# EAGLE design 11x17-base (EAGLE 7.7.0)
COPYRIGHT: Copyright (C) 2023 All Rights Reserved; DRAWN_BY: Brett A. Farnam; REV: 3.6; REV_DATE: 09/07/2023; TITLE: Values in Global Attributes
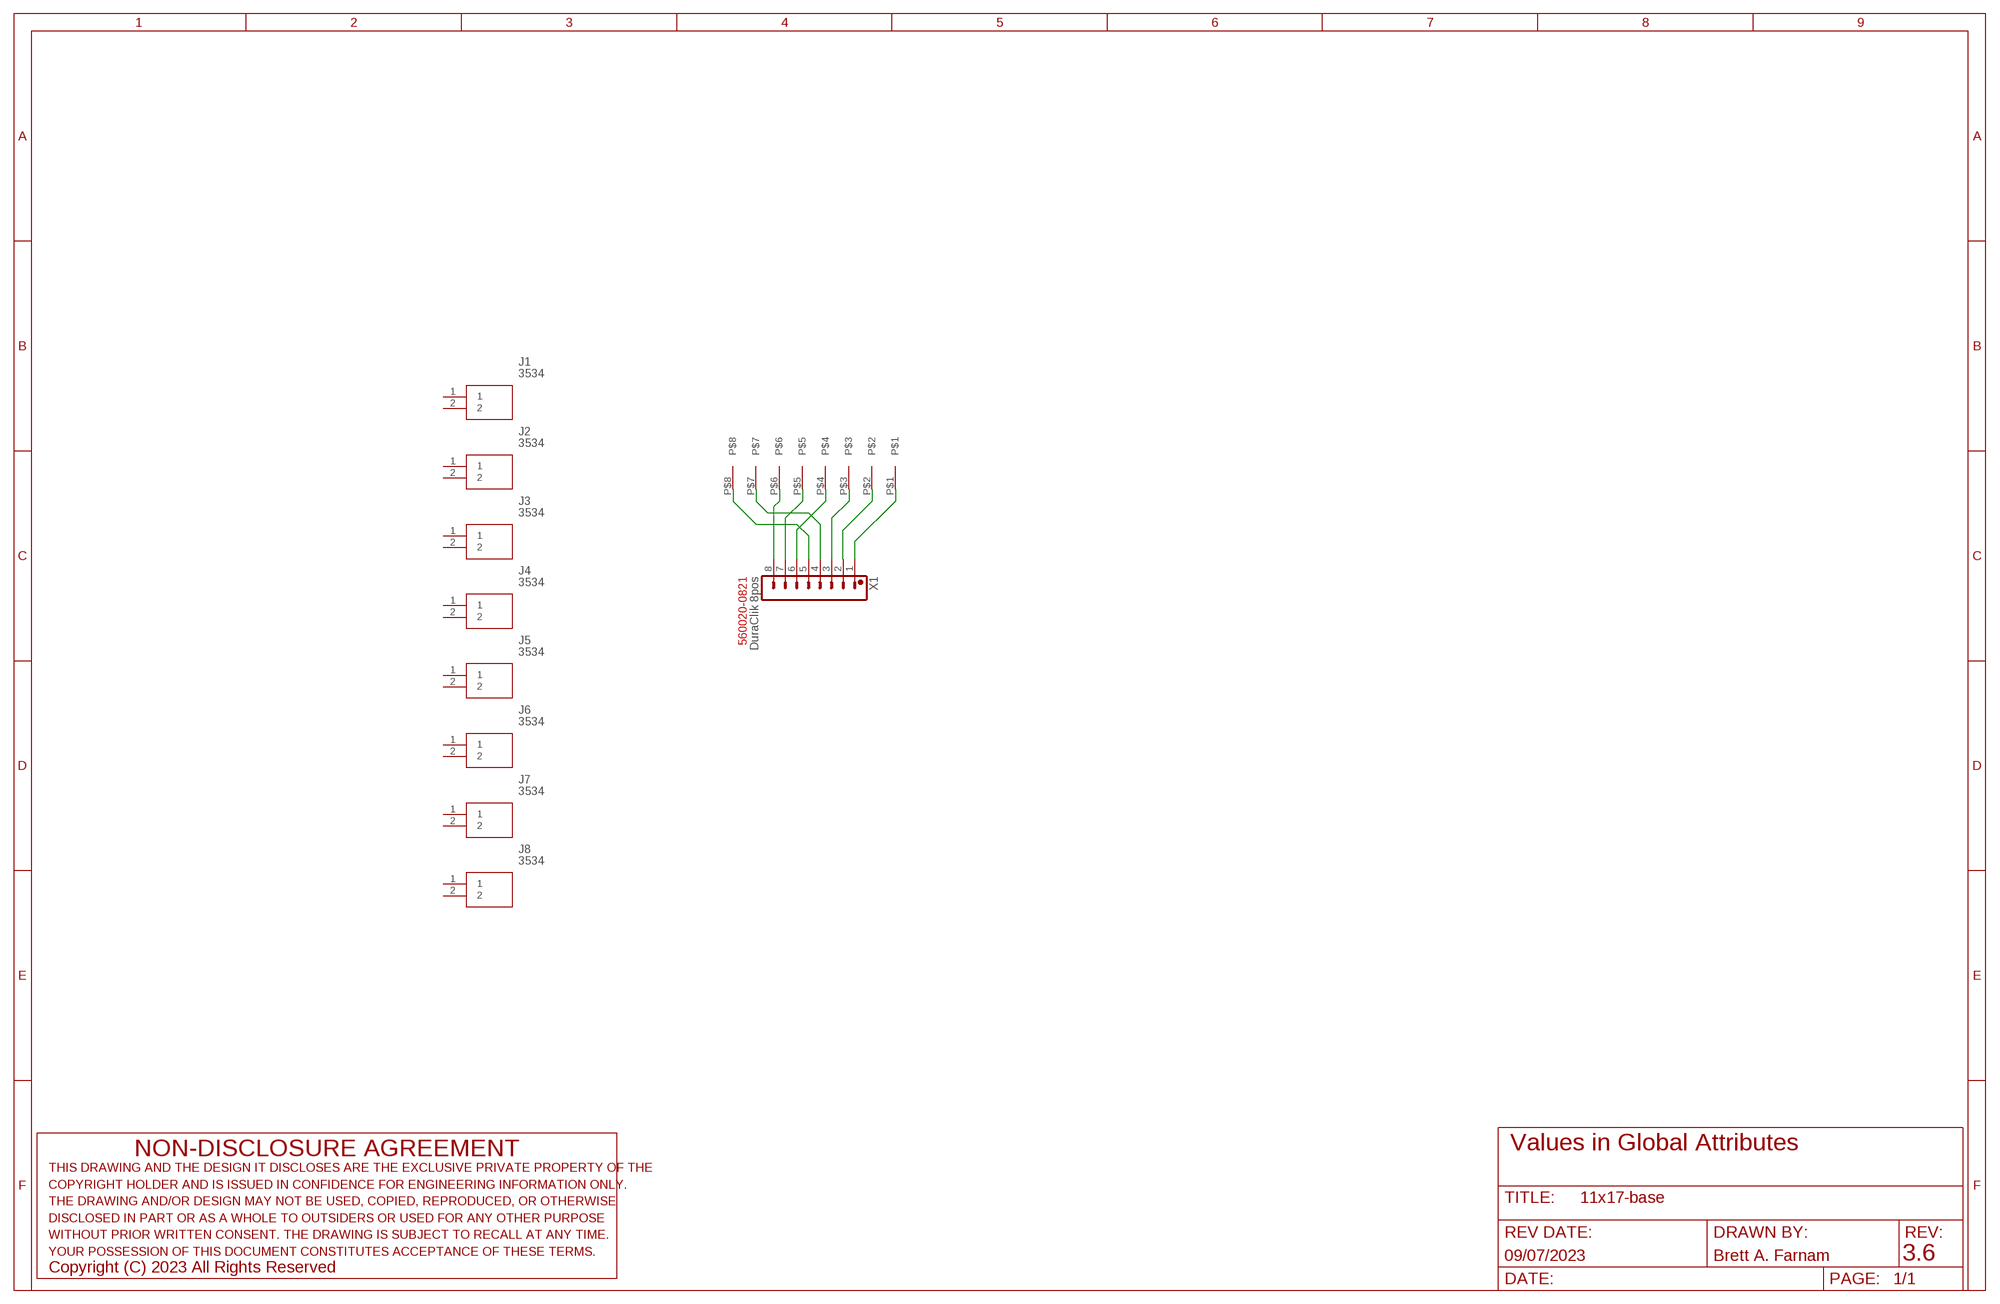
[diagram p0: schematic, sheet 1]

## Parts
J1  3534  [3534]
J2  3534  [3534]
J3  3534  [3534]
J4  3534  [3534]
J5  3534  [3534]
J6  3534  [3534]
J7  3534  [3534]
J8  3534  [3534]
U$2  YB2  [YB2___K_01]
X1  DuraClik 8pos  560020-0821  [560020-08]

## Nets
N$2: U$2.P$3 X1.3
N$3: U$2.P$2 X1.2
N$4: U$2.P$1 X1.1
N$5: U$2.P$7 X1.4
N$6: U$2.P$8 X1.5
N$7: U$2.P$4 X1.6
N$8: U$2.P$5 X1.7
N$9: U$2.P$6 X1.8
Unconnected: J1.1 J1.2 J2.1 J2.2 J3.1 J3.2 J4.1 J4.2 J5.1 J5.2 J6.1 J6.2 J7.1 J7.2 J8.1 J8.2

## Library data of the parts
J1-J8 = 3534:3534: Quick-Fit Terminal, PC; Brass; Nickel; UL Listed; 0.187 x 0.020 in.; Vertical Source: Datasheet <matthew.orford@ultra-pmes.com>; DESCRIPTION: Quick-Fit Terminal, PC; Brass; Nickel; UL Listed; 0.187 x 0.020 in.; Vertical; HEIGHT: 5.13mm; MANUFACTURER_NAME: Keystone Electronics; MANUFACTURER_PART_NUMBER: 3534; MOUSER_PART_NUMBER: 534-3534; MOUSER_PRICE-STOCK: https://www.mouser.co.uk/ProductDetail/Keystone-Electronics/3534?qs=qOqV1E1P08TvD2OZQB66cQ%3D%3D
U$2 = nkk:YB2
X1 = con-molex-duraclik:560020-08?; COLOR: Black; DIGIKEY_PN: 900-5600200821DKR-ND; MFG: Molex; MPN: 560020-0821; PLATING: Sn; SERIES: DuraClick

## Board
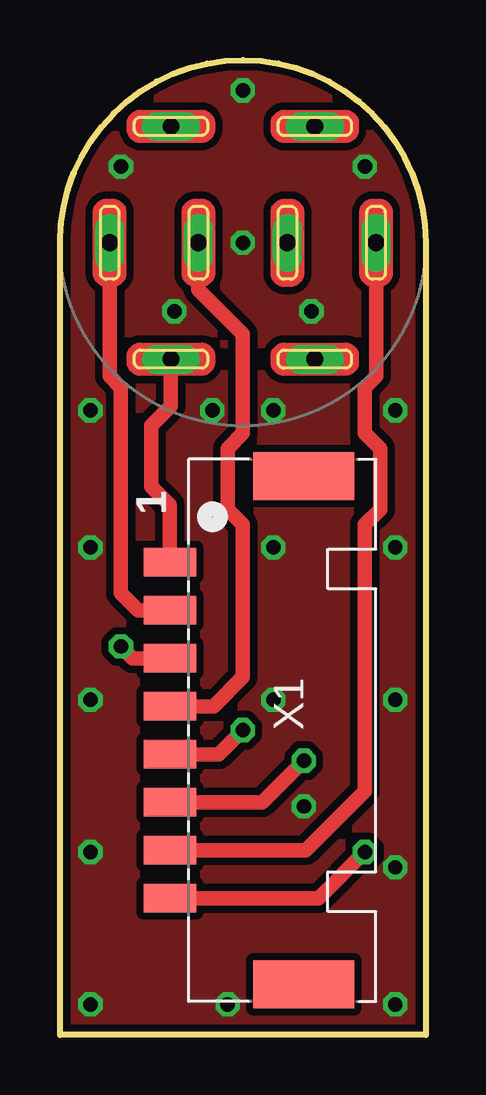
[diagram p1: board, top side]
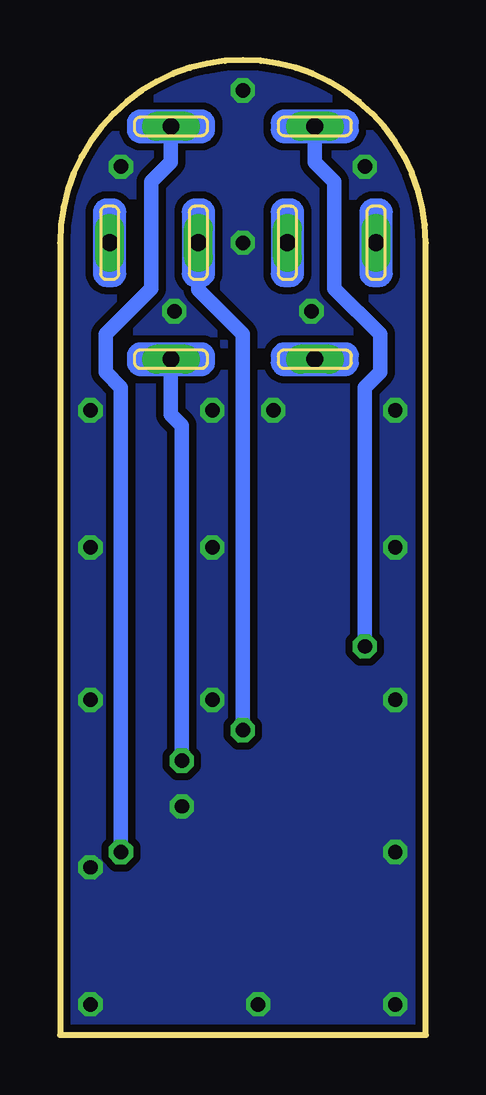
[diagram p2: board, bottom side, seen from below]

Size 15.24 x 40.64 mm. Coordinates in mm from the lower left corner, seen from the top.
Outline: 9.6,31.5 9.35,31.5 arc-90 9.09,31.75 9.09,34.29 arc-90 9.35,34.54 9.6,34.54 arc-90 9.86,34.29 9.86,31.75 arc-90 9.6,31.5
Outline: 5.89,31.5 5.64,31.5 arc-90 5.38,31.75 5.38,34.29 arc-90 5.64,34.54 5.89,34.54 arc-90 6.15,34.29 6.15,31.75 arc-90 5.89,31.5
Outline: 13.3,31.5 13.04,31.5 arc-90 12.79,31.75 12.79,34.29 arc-90 13.04,34.54 13.3,34.54 arc-90 13.55,34.29 13.55,31.75 arc-90 13.3,31.5
Outline: 2.2,31.5 1.94,31.5 arc-90 1.69,31.75 1.69,34.29 arc-90 1.94,34.54 2.2,34.54 arc-90 2.45,34.29 2.45,31.75 arc-90 2.2,31.5
Outline: 6.15,28.3 6.15,28.04 arc-90 5.89,27.79 3.35,27.79 arc-90 3.1,28.04 3.1,28.3 arc-90 3.35,28.55 5.89,28.55 arc-90 6.15,28.3
Outline: 3.1,37.74 3.1,38 arc-90 3.35,38.25 5.89,38.25 arc-90 6.15,38 6.15,37.74 arc-90 5.89,37.49 3.35,37.49 arc-90 3.1,37.74
Outline: 9.09,37.74 9.09,38 arc-90 9.35,38.25 11.89,38.25 arc-90 12.14,38 12.14,37.74 arc-90 11.89,37.49 9.35,37.49 arc-90 9.09,37.74
Outline: 12.14,28.3 12.14,28.04 arc-90 11.89,27.79 9.35,27.79 arc-90 9.09,28.04 9.09,28.3 arc-90 9.35,28.55 11.89,28.55 arc-90 12.14,28.3
Outline: 0,0 0,33.02 arc-180 15.24,33.02 15.24,0 0,0
Copper layers (1*16): Top 0.035mm / dielectric 1.5mm / Bottom 0.035mm
Design rules "default *": minimum track width 10mil, minimum drill 24mil, track to track 8mil, track to pad 8mil, pad to pad 8mil, via to via 8mil, smd to smd 8mil, copper to edge 10mil, drill to drill 8mil, minimum pad ring 10mil, minimum via ring 8mil, stop-mask expansion 4mil, vias tented up to drill 0mil, thermal gap 10mil
tRestrict: 2 lines

### Footprints (pad centres in the part's own frame; a part is rotated, then mirrored left to right if it is on the bottom)
3534 = drill 1.651 pad 2.159 octagon: 1 -1.829,0; 2 1.829,0
YB2___K_01 = drill 0.7 long: P$1 -2.997,-4.851; P$2 -5.55,0; P$3 -2.997,4.851; P$4 2.997,-4.851; P$5 5.55,0; P$6 2.997,4.851; P$7 -1.854,0; P$8 1.854,0
560020-08 = smd 1.2 x 2.2: 1 7,5.58; 2 5,5.58; 3 3,5.58; 4 1,5.58; 5 -1,5.58; 6 -3,5.58; 7 -5,5.58; 8 -7,5.58 | smd 2 x 4.2: NC$1 -10.6,0; NC$2 10.6,0

### Placement (x,y rotation side)
J1  32.56,28.17 180 top  (outside the outline)
J2  30.01,33.02 90 top  (outside the outline)
J3  32.56,37.87 0 top  (outside the outline)
J4  33.71,33.02 90 top  (outside the outline)
J5  37.41,33.02 90 top  (outside the outline)
J6  38.56,28.17 180 top  (outside the outline)
J7  41.11,33.02 90 top  (outside the outline)
J8  38.56,37.87 0 top  (outside the outline)
U$1  [FRAME_B_L]  -186.69,-99.06 0 top  (outside the outline)
U$2  7.62,33.02 0 top
X1  10.16,12.7 90 top

### Tracks (layer width: path | path; a pad name or v marks a point on that pad's centre or on a via)
GND  (via drill 0.6)
  other vias: 1.27,26.04 1.27,1.27 1.27,13.97 13.97,6.99 13.97,13.97 6.99,1.27 13.97,1.27 1.27,20.32 1.27,7.62 13.97,20.32 13.97,26.04 2.54,36.2 12.7,36.2 7.62,39.37 7.62,33.02 10.16,9.53 6.35,26.04 8.89,26.04 8.89,20.32 8.89,13.97 10.48,30.16 4.76,30.16
  pour Top (isolate 0.305, no thermals): 0.25,0 0.25,33.02 arc-180 14.99,33.02 14.99,0
  pour Bottom (isolate 0.305, no thermals): 0.25,0 0.25,33.02 arc-180 14.99,33.02 14.99,0
N$1
  pour Top: 28.19,12.7 28.19,33.02 arc-180 42.93,33.02 42.93,12.7
N$2  (via drill 0.6)
  Top 0.61: X1.3 3.03,15.7 v2.54,16.19
  Bottom 0.61: U$2.P$3 4.62,36.37 3.81,35.56 3.81,31.12 1.91,29.21 1.91,27.62 2.54,26.99 v2.54,16.19
N$3
  Top 0.61: X1.2 3.25,17.7 2.54,18.42 2.54,26.99 2.07,27.46 U$2.P$2
N$4
  Top 0.61: U$2.P$1 4.62,26.21 3.81,25.4 3.81,22.86 4.58,22.09 X1.1
N$5
  Top 0.61: U$2.P$7 5.77,31.06 7.62,29.21 7.62,25.08 6.99,24.45 6.99,21.91 7.62,21.27 7.62,14.92 6.4,13.7 X1.4
N$6  (via drill 0.6)
  Top 0.61: X1.5 6.62,11.7 v7.62,12.7
  Bottom 0.61: U$2.P$8 9.47,31.06 7.62,29.21 v7.62,12.7
N$7  (via drill 0.6)
  Top 0.61: X1.6 8.43,9.7 v10.16,11.43
  Bottom 0.61: v10.16,11.43 10.16,25.4 10.62,25.86 U$2.P$4
N$8
  Top 0.61: X1.7 10.24,7.7 12.7,10.16 12.7,21.27 13.34,21.91 13.34,24.45 12.7,25.08 12.7,26.99 13.17,27.46 U$2.P$5
N$9  (via drill 0.6)
  Top 0.61: X1.8 10.78,5.7 v12.7,7.62
  Bottom 0.61: U$2.P$6 10.62,36.37 11.43,35.56 11.43,31.12 13.34,29.21 13.34,27.62 12.7,26.99 v12.7,7.62